# Altium schematic sheet main.SchDoc: Main
size A4; Author: Samuel López; DocumentNumber: 1; SheetNumber: 1; SheetTotal: 5
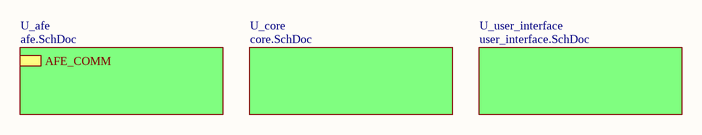
[diagram p0: main.SchDoc]

## Sub-sheets
U_afe = afe.SchDoc: AFE_COMM (harness AFE_COMM)
U_core = core.SchDoc: no entries
U_user_interface = user_interface.SchDoc: no entries

## Notes on the sheet
- Title:
- Sheet
- of
- Author:
- Date:
- Time: